# Altium schematic sheet 1_Power.SchDoc
size A; SheetNumber: 2; SheetTotal: 5
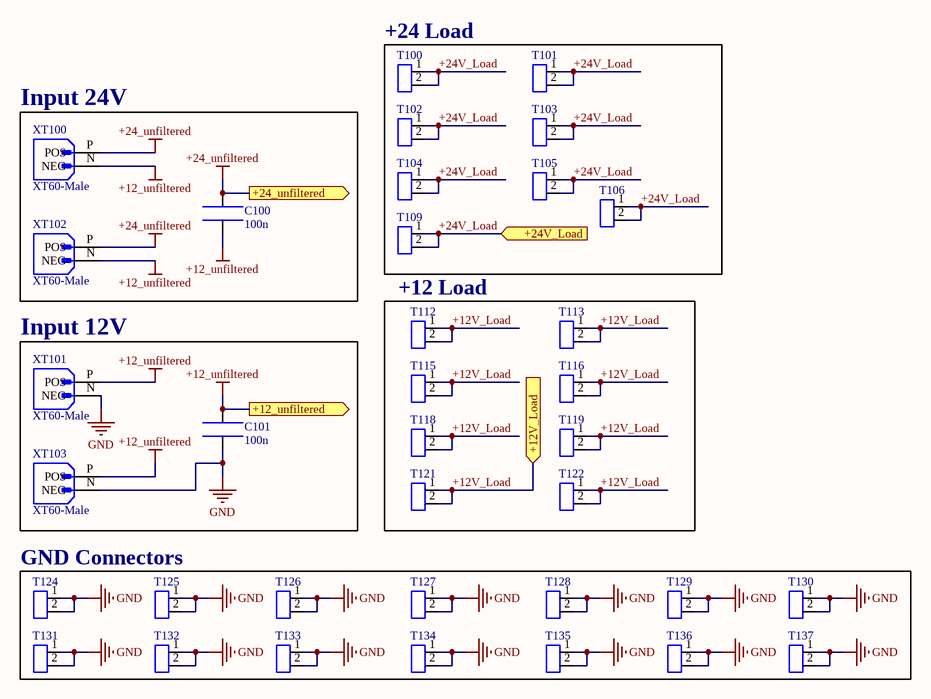
[diagram p0: 1_Power.SchDoc]

## Parts
C100  100n  [C0805]
C101  100n  [C0805]
T100  Terminal pin 6.3mm  [Terminal pin 6.3mm]  (value not drawn)
T101  Terminal pin 6.3mm  [Terminal pin 6.3mm]  (value not drawn)
T102  Terminal pin 6.3mm  [Terminal pin 6.3mm]  (value not drawn)
T103  Terminal pin 6.3mm  [Terminal pin 6.3mm]  (value not drawn)
T104  Terminal pin 6.3mm  [Terminal pin 6.3mm]  (value not drawn)
T105  Terminal pin 6.3mm  [Terminal pin 6.3mm]  (value not drawn)
T106  Terminal pin 6.3mm  [Terminal pin 6.3mm]  (value not drawn)
T109  Terminal pin 6.3mm  [Terminal pin 6.3mm]  (value not drawn)
T112  Terminal pin 6.3mm  [Terminal pin 6.3mm]  (value not drawn)
T113  Terminal pin 6.3mm  [Terminal pin 6.3mm]  (value not drawn)
T115  Terminal pin 6.3mm  [Terminal pin 6.3mm]  (value not drawn)
T116  Terminal pin 6.3mm  [Terminal pin 6.3mm]  (value not drawn)
T118  Terminal pin 6.3mm  [Terminal pin 6.3mm]  (value not drawn)
T119  Terminal pin 6.3mm  [Terminal pin 6.3mm]  (value not drawn)
T121  Terminal pin 6.3mm  [Terminal pin 6.3mm]  (value not drawn)
T122  Terminal pin 6.3mm  [Terminal pin 6.3mm]  (value not drawn)
T124  Terminal pin 6.3mm  [Terminal pin 6.3mm]  (value not drawn)
T125  Terminal pin 6.3mm  [Terminal pin 6.3mm]  (value not drawn)
T126  Terminal pin 6.3mm  [Terminal pin 6.3mm]  (value not drawn)
T127  Terminal pin 6.3mm  [Terminal pin 6.3mm]  (value not drawn)
T128  Terminal pin 6.3mm  [Terminal pin 6.3mm]  (value not drawn)
T129  Terminal pin 6.3mm  [Terminal pin 6.3mm]  (value not drawn)
T130  Terminal pin 6.3mm  [Terminal pin 6.3mm]  (value not drawn)
T131  Terminal pin 6.3mm  [Terminal pin 6.3mm]  (value not drawn)
T132  Terminal pin 6.3mm  [Terminal pin 6.3mm]  (value not drawn)
T133  Terminal pin 6.3mm  [Terminal pin 6.3mm]  (value not drawn)
T134  Terminal pin 6.3mm  [Terminal pin 6.3mm]  (value not drawn)
T135  Terminal pin 6.3mm  [Terminal pin 6.3mm]  (value not drawn)
T136  Terminal pin 6.3mm  [Terminal pin 6.3mm]  (value not drawn)
T137  Terminal pin 6.3mm  [Terminal pin 6.3mm]  (value not drawn)
XT100  XT60-Male  [XT60-Male]
XT101  XT60-Male  [XT60-Male]
XT102  XT60-Male  [XT60-Male]
XT103  XT60-Male  [XT60-Male]

## Blocks framed on the sheet
+24 Load: T100-T106 T109
Input 24V: C100 XT100 XT102
+12 Load: T112 T113 T115 T116 T118 T119 T121 T122
Input 12V: C101 XT101 XT103
GND Connectors: T124-T137

## Ports
+12_unfiltered (out, see 0_overview[3B]), +12V_Load (in, see 0_overview[2B], 2_CircuitBreaker[2B]), +24_unfiltered (out, see 0_overview[3B], 4_Protection[1B]), +24V_Load (in, see 0_overview[2B])

## Nets
+12_unfiltered: C100.1 C101.1 XT100.N(NEG) XT101.P(POS) XT102.N(NEG) XT103.P(POS) ; port +12_unfiltered
+24_unfiltered: C100.1 XT100.P(POS) XT102.P(POS) ; port +24_unfiltered
GND: C101.1 T124.1 T124.2 T125.1 T125.2 T126.1 T126.2 T127.1 T127.2 T128.1 T128.2 T129.1 T129.2 T130.1 T130.2 T131.1 T131.2 T132.1 T132.2 T133.1 T133.2 T134.1 T134.2 T135.1 T135.2 T136.1 T136.2 T137.1 T137.2 XT101.N(NEG) XT103.N(NEG)
+12V_Load: T112.1 T112.2 T113.1 T113.2 T115.1 T115.2 T116.1 T116.2 T118.1 T118.2 T119.1 T119.2 T121.1 T121.2 T122.1 T122.2 ; port +12V_Load
+24V_Load: T100.1 T100.2 T101.1 T101.2 T102.1 T102.2 T103.1 T103.2 T104.1 T104.2 T105.1 T105.2 T106.1 T106.2 T109.1 T109.2 ; port +24V_Load

## Library data of the parts
C100 C101 = C0805
XT100-XT103 = XT60-Male: Plug; DC supply; XT60; male; PIN: 2; for cable; soldered; 30A; 500V; MP: XT60-M; MF: AMASS; Price: None; Availability: Not in stock; Package: Package; Value: *; SnapEDA_Link: https://www.snapeda.com/parts/XT60-M/AMASS/view-part/?ref=snap; Check_prices: https://www.snapeda.com/parts/XT60-M/AMASS/view-part/?ref=eda